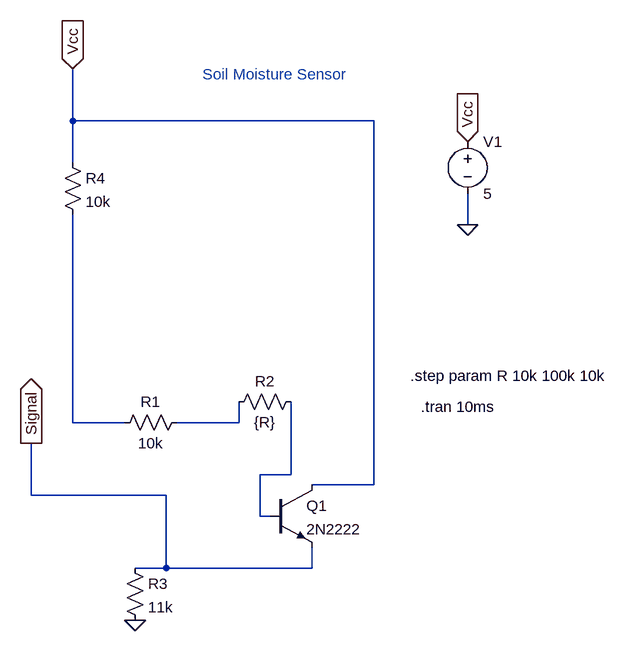
[diagram p0: schematic soil_moisture_sensor.asc]
soil_moisture_sensor.asc, the LTspice schematic file:
Version 4
SHEET 1 948 680
WIRE 96 -384 96 -464
WIRE 560 -384 96 -384
WIRE 96 -320 96 -384
WIRE 704 -224 704 -272
WIRE 96 80 96 -240
WIRE 176 80 96 80
WIRE 352 80 352 48
WIRE 352 80 256 80
WIRE 432 160 432 48
WIRE 432 160 384 160
WIRE 560 176 560 -384
WIRE 560 176 464 176
WIRE 32 192 32 112
WIRE 240 192 32 192
WIRE 384 224 384 160
WIRE 400 224 384 224
WIRE 240 304 240 192
WIRE 240 304 192 304
WIRE 464 304 464 272
WIRE 464 304 240 304
FLAG 192 384 0
FLAG 32 112 Signal
IOPIN 32 112 Out
FLAG 96 -464 Vcc
IOPIN 96 -464 In
FLAG 704 -352 Vcc
IOPIN 704 -352 In
FLAG 704 -224 0
SYMBOL res 272 64 R90
WINDOW 0 0 56 VBottom 2
WINDOW 3 32 56 VTop 2
SYMATTR InstName R1
SYMATTR Value 10k
SYMBOL npn 400 176 R0
SYMATTR InstName Q1
SYMATTR Value 2N2222
SYMBOL res 448 32 R90
WINDOW 0 0 56 VBottom 2
WINDOW 3 32 56 VTop 2
SYMATTR InstName R2
SYMATTR Value {R}
SYMBOL res 176 288 R0
SYMATTR InstName R3
SYMATTR Value 11k
SYMBOL res 80 -336 R0
SYMATTR InstName R4
SYMATTR Value 10k
SYMBOL voltage 704 -368 R0
SYMATTR InstName V1
SYMATTR Value 5
TEXT 632 56 Left 2 !.tran 10ms
TEXT 616 8 Left 2 !.step param R 10k 100k 10k
TEXT 296 -456 Left 2 ;Soil Moisture Sensor

The netlist it stands for:
* soil_moisture_sensor.asc
R1 N002 N001 10k
Q1 Vcc N003 Signal 0 2N2222
R2 N003 N002 {R}
R3 Signal 0 11k
R4 Vcc N001 10k
V1 Vcc 0 5
.model NPN NPN
.model PNP PNP
.lib standard.bjt
.tran 10ms
.step param R 10k 100k 10k
* Soil Moisture Sensor
.backanno
.end